# EAGLE design FilterSupply_single_simplified_layout (EAGLE 7.7.0)

## Sheet 1 of 2
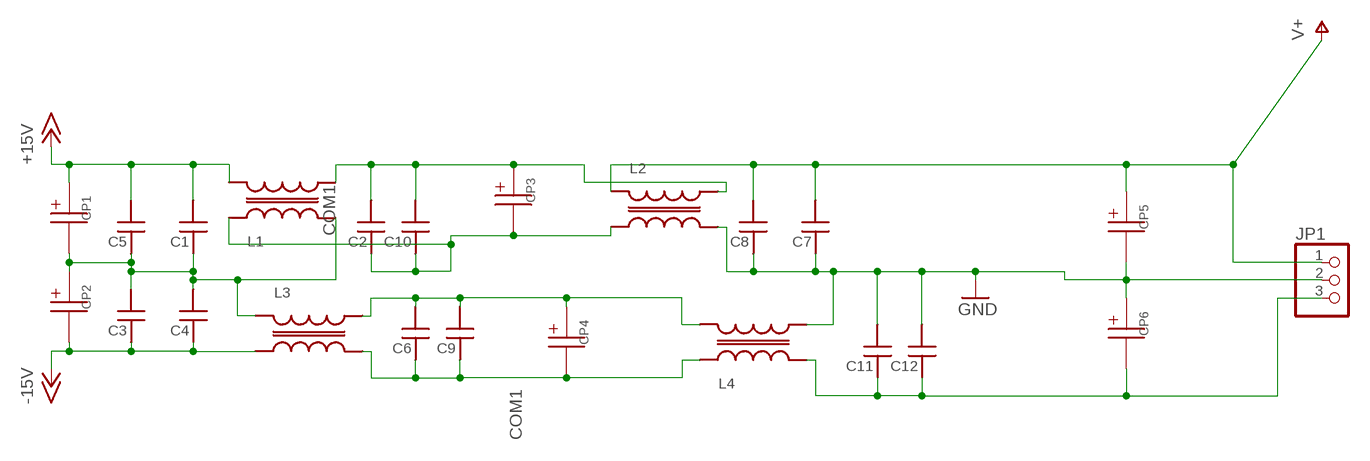
[diagram p0: schematic, sheet 1]

### Parts
C1  C_MLCC_SMDCMLCC_0805  [C_MLCC_0805]
C2  C_MLCC_SMDCMLCC_0603  [C_MLCC_0603]
C3  C_MLCC_SMDCMLCC_0805  [C_MLCC_0805]
C4  C_MLCC_SMDCMLCC_0805  [C_MLCC_0805]
C5  C_MLCC_SMDCMLCC_0805  [C_MLCC_0805]
C6  C_MLCC_SMDCMLCC_0603  [C_MLCC_0603]
C7  C_MLCC_SMDCMLCC_0603  [C_MLCC_0603]
C8  C_MLCC_SMDCMLCC_0603  [C_MLCC_0603]
C9  C_MLCC_SMDCMLCC_0603  [C_MLCC_0603]
C10  C_MLCC_SMDCMLCC_0603  [C_MLCC_0603]
C11  C_MLCC_SMDCMLCC_0603  [C_MLCC_0603]
C12  C_MLCC_SMDCMLCC_0603  [C_MLCC_0603]
CP1  CAP-POLPANASONIC_F  [PANASONIC_F]
CP2  CAP-POLPANASONIC_F  [PANASONIC_F]
CP3  CAP-POLPANASONIC_F  [PANASONIC_F]
CP4  CAP-POLPANASONIC_F  [PANASONIC_F]
CP5  CAP-POLPANASONIC_F  [PANASONIC_F]
CP6  CAP-POLPANASONIC_F  [PANASONIC_F]
JP1  PINHD-1X3  [1X03]
L1  MSD7342  [MSD7342]
L2  MSD7342  [MSD7342]
L3  MSD7342  [MSD7342]
L4  MSD7342  [MSD7342]

### Nets
+15V: C1.P$2 C5.P$2 CP1.+ L1.1
-15V: C3.P$1 C4.P$1 CP2.- L3.1
COM1: C1.P$1 C3.P$2 C4.P$2 C5.P$1 CP1.- CP2.+ L1.4 L3.2
GND: C7.P$1 C8.P$1 C11.P$2 C12.P$2 CP5.- CP6.+ JP1.2 L2.3 L4.3
N$1: C2.P$2 C10.P$2 CP3.+ L1.3 L2.4
N$3: C2.P$1 C10.P$1 CP3.- L1.2 L2.1
N$4: C6.P$2 C9.P$2 CP4.+ L3.4 L4.1
N$5: C6.P$1 C9.P$1 CP4.- L3.3 L4.2
N$8: C11.P$1 C12.P$1 CP6.- JP1.3 L4.4
V+: C7.P$2 C8.P$2 CP5.+ JP1.1 L2.2

## Sheet 2 of 2
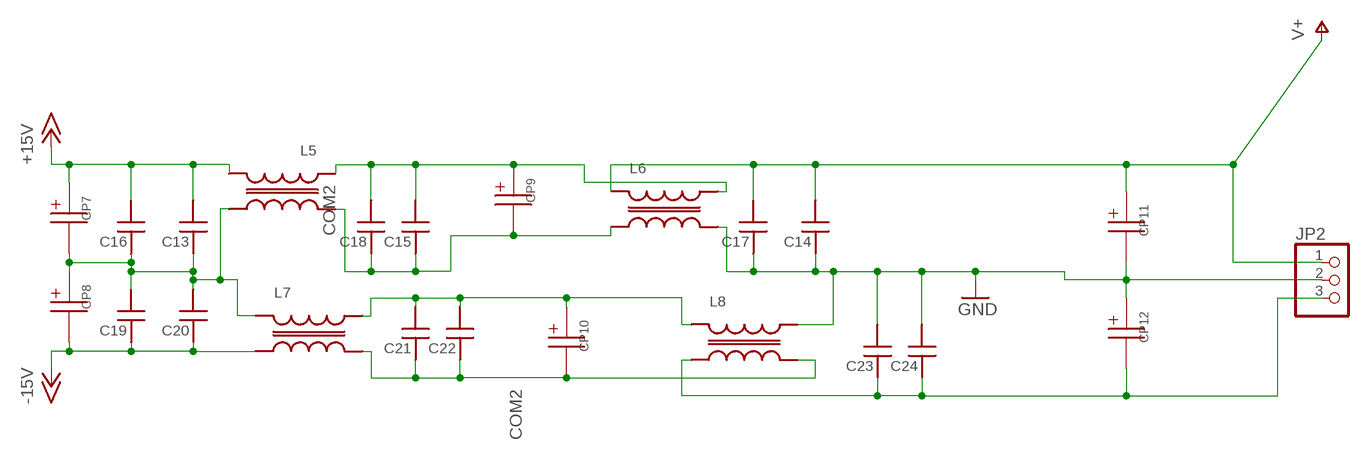
[diagram p1: schematic, sheet 2]

### Parts
C13  C_MLCC_SMDCMLCC_0805  [C_MLCC_0805]
C14  C_MLCC_SMDCMLCC_0603  [C_MLCC_0603]
C15  C_MLCC_SMDCMLCC_0603  [C_MLCC_0603]
C16  C_MLCC_SMDCMLCC_0805  [C_MLCC_0805]
C17  C_MLCC_SMDCMLCC_0603  [C_MLCC_0603]
C18  C_MLCC_SMDCMLCC_0603  [C_MLCC_0603]
C19  C_MLCC_SMDCMLCC_0805  [C_MLCC_0805]
C20  C_MLCC_SMDCMLCC_0805  [C_MLCC_0805]
C21  C_MLCC_SMDCMLCC_0603  [C_MLCC_0603]
C22  C_MLCC_SMDCMLCC_0603  [C_MLCC_0603]
C23  C_MLCC_SMDCMLCC_0603  [C_MLCC_0603]
C24  C_MLCC_SMDCMLCC_0603  [C_MLCC_0603]
CP7  CAP-POLPANASONIC_F  [PANASONIC_F]
CP8  CAP-POLPANASONIC_F  [PANASONIC_F]
CP9  CAP-POLPANASONIC_F  [PANASONIC_F]
CP10  CAP-POLPANASONIC_F  [PANASONIC_F]
CP11  CAP-POLPANASONIC_F  [PANASONIC_F]
CP12  CAP-POLPANASONIC_F  [PANASONIC_F]
JP2  PINHD-1X3  [1X03]
L5  MSD7342  [MSD7342]
L6  MSD7342  [MSD7342]
L7  MSD7342  [MSD7342]
L8  MSD7342  [MSD7342]

### Nets
+15V2: C13.P$2 C16.P$2 CP7.+ L5.4 ; supply symbol labelled +15V
-15V2: C19.P$1 C20.P$1 CP8.- L7.1 ; supply symbol labelled -15V
COM2: C13.P$1 C16.P$1 C19.P$2 C20.P$2 CP7.- CP8.+ L5.3 L7.2
GND2: C14.P$1 C17.P$1 C23.P$2 C24.P$2 CP11.- CP12.+ JP2.2 L6.3 L8.4 ; supply symbol labelled GND
N$6: C15.P$2 C18.P$2 CP9.+ L5.2 L6.4
N$7: C15.P$1 C18.P$1 CP9.- L5.1 L6.1
N$9: C21.P$2 C22.P$2 CP10.+ L7.4 L8.2
N$10: C21.P$1 C22.P$1 CP10.- L7.3 L8.3
N$13: C23.P$1 C24.P$1 CP12.- JP2.3 L8.1
V+2: C14.P$2 C17.P$2 CP11.+ JP2.1 L6.2 ; supply symbol labelled V+

## Library data of the parts
C1-C24 = jqi_passives:C_MLCC_SMD
CP1-CP12 = rlc-jqi:CAP-POL: Polarized SMT Capacitor
JP1 JP2 = pinhead:PINHD-1X3: PIN HEADER
L1-L8 = coilcraft-jqi:MSD7342: MSD1260 series 1:1 coupled inductors

## Board
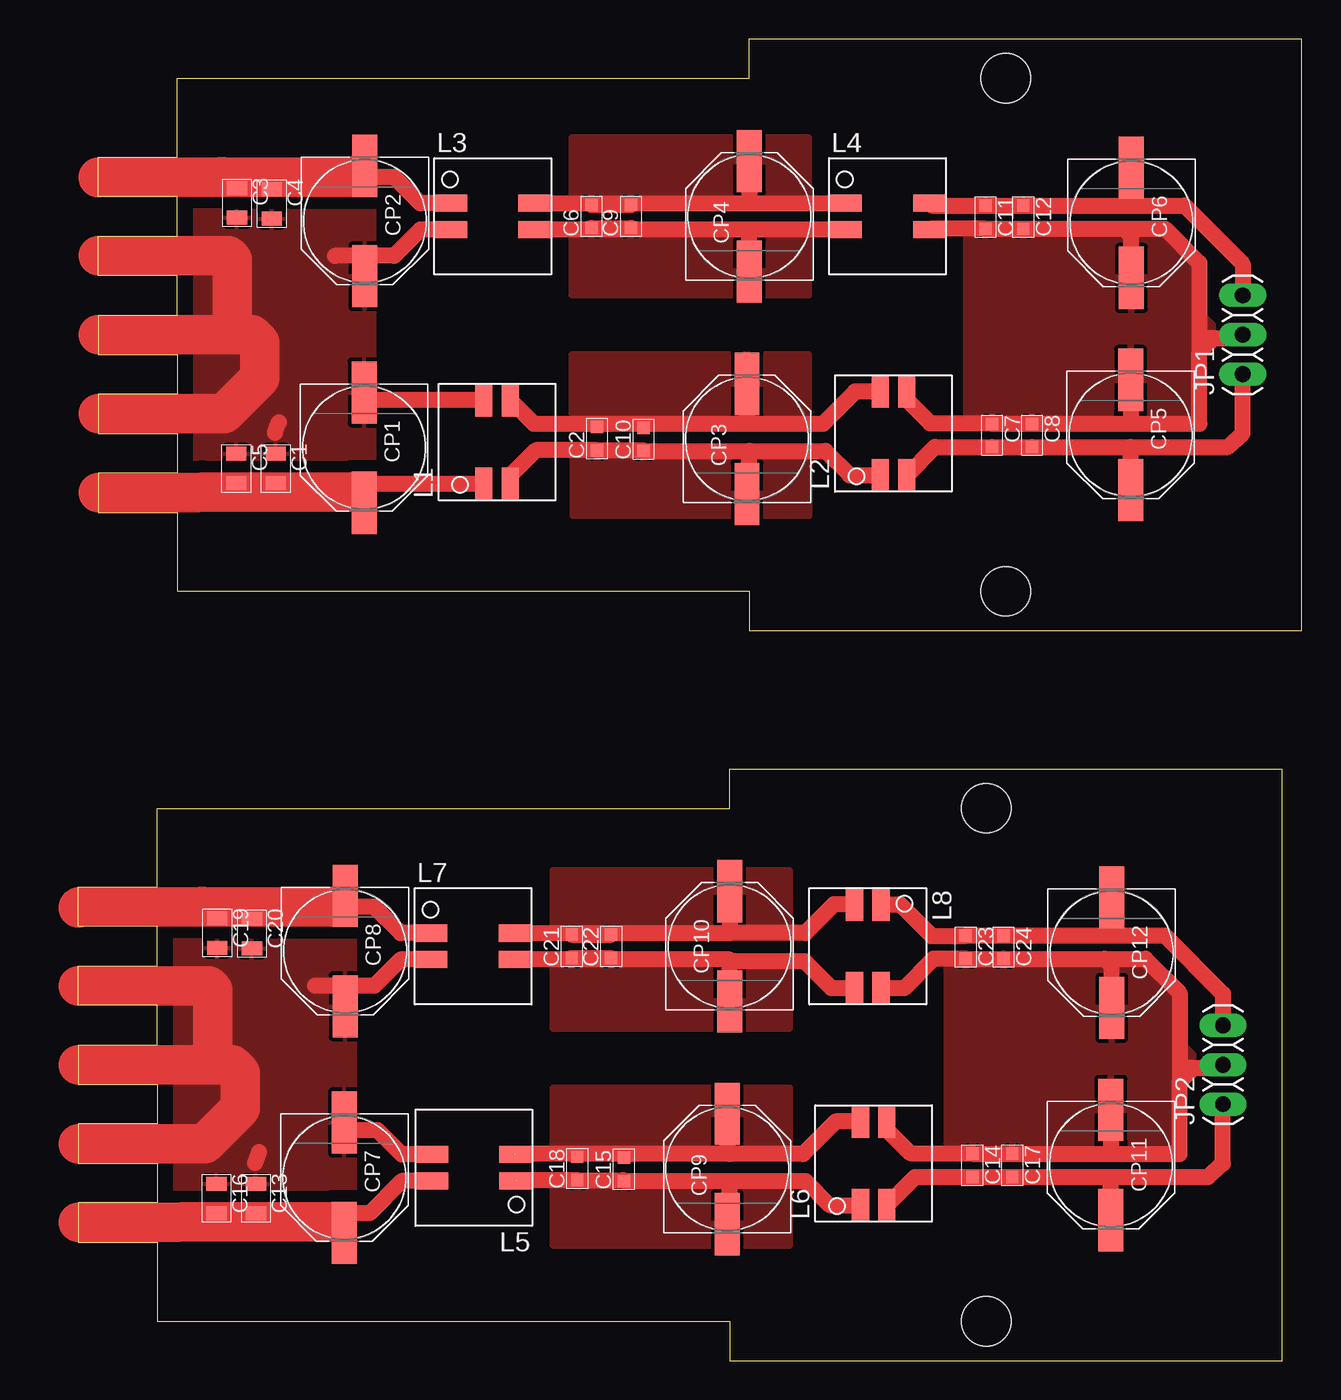
[diagram p2: board, top side]

Size 78.74 x 85.09 mm. Coordinates in mm from the lower left corner, seen from the top.
Outline: 1.27,67.31 1.27,64.77 6.35,64.77 6.35,62.23 1.27,62.23 1.27,59.69 6.35,59.69 6.35,57.15 1.27,57.15 1.27,54.61 6.35,54.61 6.35,49.53 43.18,49.53 43.18,46.99 78.74,46.99 78.74,85.09 43.18,85.09 43.18,82.55 6.35,82.55 6.35,77.47 1.27,77.47 1.27,74.93 6.35,74.93 6.35,72.39 1.27,72.39 1.27,69.85 6.35,69.85 6.35,67.31 1.27,67.31
Outline: 0,20.32 0,17.78 5.08,17.78 5.08,15.24 0,15.24 0,12.7 5.08,12.7 5.08,10.16 0,10.16 0,7.62 5.08,7.62 5.08,2.54 41.91,2.54 41.91,0 77.47,0 77.47,38.1 41.91,38.1 41.91,35.56 5.08,35.56 5.08,30.48 0,30.48 0,27.94 5.08,27.94 5.08,25.4 0,25.4 0,22.86 5.08,22.86 5.08,20.32 0,20.32
Copper layers (1*16): Top 0.035mm / dielectric 1.5mm / Bottom 0.035mm
Design rules "default *": minimum track width 10mil, minimum drill 0.6mm, track to track 8mil, track to pad 8mil, pad to pad 8mil, via to via 8mil, smd to smd 8mil, copper to edge 40mil, drill to drill 8mil, minimum pad ring 10mil, minimum via ring 8mil, stop-mask expansion 4mil, vias tented up to drill 0mil, thermal gap 10mil
Holes 3.17 mm at 59.69,82.55 59.69,49.53 58.42,35.56 58.42,2.54

### Footprints (pad centres in the part's own frame; a part is rotated, then mirrored left to right if it is on the bottom)
C_MLCC_0805 = smd 0.9 x 1.3: P$1 -0.95,0; P$2 0.95,0
C_MLCC_0603 = smd 0.8 x 0.8: P$1 -0.75,0; P$2 0.75,0
PANASONIC_F = smd 4 x 1.6: + 3.55,0; - -3.55,0
1X03 = drill 1.016 long: 1 -2.54,0; 2 0,0; 3 2.54,0
MSD7342 = smd 2.1 x 1.1: 1 -2.7,0.85; 2 -2.7,-0.85; 3 2.7,-0.85; 4 2.7,0.85

### Placement (x,y rotation side)
C1  12.7,57.43 270 top
C2  33.38,59.36 90 top
C3  10.21,74.52 270 top
C4  12.45,74.47 270 top
C5  10.16,57.43 270 top
C6  33.02,73.66 90 top
C7  58.8,59.56 270 top
C8  61.37,59.56 270 top
C9  35.56,73.66 90 top
C10  36.37,59.31 90 top
C11  58.37,73.61 270 top
C12  60.81,73.61 270 top
C13  11.43,10.44 270 top
C14  57.53,12.57 270 top
C15  35.1,12.32 90 top
C16  8.89,10.44 270 top
C17  60.1,12.57 270 top
C18  32.11,12.37 90 top
C19  8.94,27.53 270 top
C20  11.18,27.48 270 top
C21  31.75,26.67 90 top
C22  34.29,26.67 90 top
C23  57.1,26.62 270 top
C24  59.54,26.62 270 top
CP1  18.39,58.78 270 top
CP2  18.44,73.36 270 top
CP3  43.03,59.33 90 top
CP4  43.18,73.66 90 top
CP5  67.72,59.59 270 top
CP6  67.77,73.25 270 top
CP7  17.12,11.79 270 top
CP8  17.17,26.37 270 top
CP9  41.76,12.34 90 top
CP10  41.91,26.67 90 top
CP11  66.45,12.6 270 top
CP12  66.5,26.26 270 top
JP1  74.93,66.04 90 top
JP2  73.66,19.05 90 top
L1  26.95,59.13 90 top
L2  52.45,59.69 90 top
L3  26.67,73.66 0 top
L4  52.07,73.66 0 top
L5  25.45,12.42 180 top
L6  51.18,12.7 90 top
L7  25.4,26.67 0 top
L8  50.8,26.67 270 top

### Tracks (layer width: path | path; a pad name or v marks a point on that pad's centre or on a via)
+15V
  Top 0.406: 6.09,55.92 5.08,55.92 7.62,55.88
  Top 0.508: C1.P$2 12.57,56.07 12.57,55.92 | C5.P$2 10.29,56.07 10.29,55.92 | 17.78,55.88 18.29,55.88 CP1.+
  Top 1.016: 12.57,55.92 10.29,55.92 8,55.92 6.09,55.92 4.32,55.92 4.32,55.88 | L1.1 17.78,56.43 17.78,55.92
  Top 2.54: 7.62,55.88 1.27,55.88 | 8,55.92 17.78,55.92 17.78,55.88
+15V2
  Top 0.406: 4.81,8.93 3.81,8.93 6.35,8.89
  Top 0.508: C13.P$2 11.3,9.08 11.3,8.93 | C16.P$2 9.02,9.08 9.02,8.93 | 16.51,8.89 17.02,8.89 CP7.+
  Top 1.016: 11.3,8.93 9.02,8.93 6.73,8.93 4.81,8.93 3.05,8.93 3.05,8.89 | 16.51,9.44 16.51,8.93 | L5.4 20.82,11.57 18.75,9.5 16.97,9.5 16.97,8.39 CP7.+
  Top 2.54: 6.35,8.89 0,8.89 | 6.73,8.93 16.51,8.93 16.51,8.89
-15V
  Top 0.508: C3.P$1 10.07,75.68 arc-90 8.89,76.2 | 17.78,76.2 18.44,76.2 CP2.- | 10.21,76.56 11.94,75.34 C4.P$1
  Top 1.016: C3.P$1 10.21,76.56 arc90 9.3,76.2 | L3.1 22.01,74.51 20.32,76.2 18.44,76.2
  Top 2.54: 9.3,76.2 arc90 9.14,76.2 | 9.14,76.2 8.89,76.2 1.32,76.2 arc90 1.27,76.15 | 9.14,76.2 9.3,76.2 | 9.3,76.2 17.78,76.2
-15V2
  Top 0.508: C19.P$1 8.8,28.69 arc-90 7.62,29.21 | 16.51,29.21 17.17,29.21 CP8.- | 8.94,29.57 10.67,28.35 C20.P$1
  Top 1.016: C19.P$1 8.94,29.57 arc90 8.03,29.21 | L7.1 20.74,27.52 19.05,29.21 17.17,29.21
  Top 2.54: 8.03,29.21 arc90 7.87,29.21 | 7.87,29.21 7.62,29.21 0.05,29.21 arc90 0,29.16 | 7.87,29.21 8.03,29.21 | 8.03,29.21 16.51,29.21
COM1
  Top 1.016: 12.65,59.72 12.91,60.41 | L1.4 18.39,61.83 CP1.- | L3.2 22.01,72.81 20.32,71.12 16.51,71.12
  Top 1.524: 8.38,71.12 7.87,71.12
  Top 2.54: 1.27,71.12 7.87,71.12 9.65,71.12 9.91,70.87 9.91,66.8 9.14,66.04 | 9.14,66.04 1.27,66.04 | 9.14,66.04 11.18,66.04 11.68,65.53 11.68,63.25 9.4,60.96 1.27,60.96
  pour Top (isolate 0.762): 1.27,80.01 19.05,80.01 19.05,52.07 1.27,52.07
COM2
  Top 1.016: 11.38,12.73 11.64,13.42 | 17.12,14.84 CP7.- 17.62,14.83 19.25,14.83 20.82,13.27 L5.3 | L7.2 20.74,25.82 19.05,24.13 15.24,24.13
  Top 1.524: 7.11,24.13 6.6,24.13
  Top 2.54: 0,24.13 6.6,24.13 8.38,24.13 8.64,23.88 8.64,19.81 7.87,19.05 | 7.87,19.05 0,19.05 | 7.87,19.05 9.91,19.05 10.41,18.54 10.41,16.26 8.13,13.97 0,13.97
  pour Top (isolate 0.762): 0,33.02 17.78,33.02 17.78,5.08 0,5.08
GND
  Top 1.016: L2.3 53.3,61.86 54.81,60.35 58.76,60.35 C7.P$1 C8.P$1 67.72,60.31 | 67.72,60.31 72.12,60.31 72.14,60.3 72.14,64.92 | 72.14,64.92 73.05,65.84 | 73.05,65.84 74.73,65.84 JP1.2 | L4.3 54.82,72.86 C11.P$2 C12.P$2 67.31,72.86 | 72.14,64.92 72.14,70.66 69.94,72.86 67.31,72.86 | 73.05,65.84 72.19,65.84 | CP5.- 67.72,60.31 | CP6.+ 67.77,72.4 67.31,72.86
  pour Top: 57.15,72.39 69.85,72.39 72.39,69.85 72.39,67.31 73.66,66.04 72.39,64.77 72.39,60.96 57.15,60.96
GND2
  Top 1.016: L6.3 52.03,14.87 53.54,13.36 57.49,13.36 C14.P$1 C17.P$1 66.45,13.32 | 66.45,13.32 70.85,13.32 70.87,13.31 70.87,17.93 | 70.87,17.93 71.78,18.85 | 71.78,18.85 73.46,18.85 JP2.2 | 70.87,17.93 70.87,23.67 68.67,25.87 66.04,25.87 | 71.78,18.85 70.92,18.85 | CP11.- 66.45,13.32 | 66.04,25.87 C24.P$2 C23.P$2 55.03,25.87 53.14,23.98 L8.4 | CP12.+ 66.5,25.41 66.04,25.87
  pour Top: 55.88,25.4 68.58,25.4 71.12,22.86 71.12,20.32 72.39,19.05 71.12,17.78 71.12,13.97 55.88,13.97
N$1
  Top 0.508: C2.P$2 33.19,60.3 33.02,60.3 | C10.P$2 36.61,60.3 36.83,60.3
  Top 1.016: L2.4 50,62.39 47.9,60.3 43.18,60.3 | 43.18,60.3 36.83,60.3 33.02,60.3 29.33,60.3 L1.3 | CP3.+ 43.03,60.45 43.18,60.3
  pour Top: 31.75,60.96 31.75,64.77 46.99,64.77 46.99,60.96
N$2
  cutout Top: 22.81,63.25 31.14,63.25 31.14,55.07 22.81,55.07
  cutout Top: 48.26,64.06 56.64,64.06 56.64,55.68 48.26,55.68
  cutout Top: 22.56,77.83 30.89,77.83 30.89,69.44 22.56,69.44
  cutout Top: 47.96,77.83 56.29,77.83 56.29,69.44 47.96,69.44
N$3
  Top 1.016: 43.18,58.56 C10.P$1 36.32,58.61 C2.P$1 29.45,58.61 27.84,57 27.84,56.03 27.8,56.07 L1.2 | 43.18,58.56 48.07,58.56 49.63,57 L2.1 | CP3.- 43.18,55.94 43.18,58.56
  pour Top: 31.8,54.41 31.8,58.22 47.04,58.22 47.04,54.41
N$4
  Top 1.016: L3.4 33.02,74.51 | 33.02,74.51 43.18,74.51 | 43.18,74.51 L4.1 | CP4.+ 43.18,74.51 | 33.02,74.51 C6.P$2 C9.P$2
  pour Top: 31.75,74.93 31.75,78.74 46.99,78.74 46.99,74.93
N$5
  Top 1.016: L4.2 43.18,72.81 | 43.18,72.81 L3.3 32.92,72.81 C6.P$1 C9.P$1 | CP4.- 43.18,72.81
  pour Top: 31.75,68.58 31.75,72.39 46.99,72.39 46.99,68.58
N$6  (1 unrouted)
  Top 0.508: C18.P$2 31.92,13.31 31.75,13.31 | C15.P$2 35.34,13.31 35.56,13.31
  Top 1.016: L6.4 48.73,15.4 46.63,13.31 41.91,13.31 | 41.91,13.31 35.56,13.31 31.75,13.31 28.06,13.31 | CP9.+ 41.76,13.46 41.91,13.31
  pour Top: 30.53,13.77 30.53,17.58 45.77,17.58 45.77,13.77
N$7  (1 unrouted)
  Top 1.016: 41.91,11.57 C15.P$1 35.05,11.62 C18.P$1 28.18,11.62 | 41.91,11.57 46.8,11.57 48.36,10.01 L6.1 | CP9.- 41.91,8.95 41.91,11.57
  pour Top: 30.53,7.42 30.53,11.23 45.77,11.23 45.77,7.42
N$8
  Top 1.016: L4.4 54.92,74.36 C11.P$1 C12.P$1 67.31,74.36 | JP1.3 74.93,70.61 71.18,74.36 67.31,74.36 | CP6.- 67.77,74.82 67.31,74.36
N$9
  Top 1.016: L7.4 31.75,27.52 | 31.75,27.52 41.91,27.52 | CP10.+ 41.91,27.52 | 31.75,27.52 C21.P$2 C22.P$2 | L8.2 48.62,29.37 46.79,27.53 41.92,27.53 41.91,27.52
  pour Top: 30.53,27.74 30.53,31.55 45.77,31.55 45.77,27.74
N$10
  Top 1.016: C22.P$1 C21.P$1 31.65,25.82 L7.3 41.91,25.82 41.91,25.4 | CP10.- 41.91,25.4 | L8.3 48.47,23.97 46.74,25.71 42.22,25.71 41.91,25.4
  pour Top: 30.53,21.39 30.53,25.2 45.77,25.2 45.77,21.39
N$12
  cutout Top: 21.54,16.26 29.87,16.26 29.87,8.08 21.54,8.08
  cutout Top: 46.99,17.07 55.37,17.07 55.37,8.69 46.99,8.69
  cutout Top: 21.29,30.84 29.62,30.84 29.62,22.45 21.29,22.45
  cutout Top: 46.69,30.84 55.02,30.84 55.02,22.45 46.69,22.45
N$13
  Top 1.016: JP2.3 73.66,23.62 69.91,27.37 66.04,27.37 | 66.04,27.37 C24.P$1 C23.P$1 57.06,27.33 54.92,27.33 52.88,29.37 L8.1 | CP12.- 66.5,27.83 66.04,27.37
V+
  Top 1.016: L2.2 55.12,58.81 C7.P$2 C8.P$2 67.72,58.81 | 67.72,58.81 73.95,58.81 74.93,59.69 JP1.1 | CP5.+ 67.72,58.81
V+2
  Top 1.016: L6.2 53.85,11.82 C14.P$2 C17.P$2 66.45,11.82 | 66.45,11.82 72.68,11.82 73.66,12.7 JP2.1 | CP11.+ 66.45,11.82